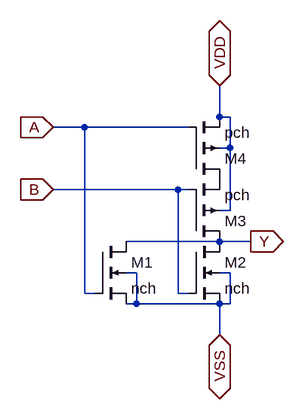
[diagram p0: schematic nor2.asc]
nor2.asc, the LTspice schematic file:
Version 4
SHEET 1 880 680
WIRE 272 0 272 -48
WIRE 288 0 272 0
WIRE 64 16 16 16
WIRE 224 16 64 16
WIRE 288 48 288 0
WIRE 288 48 272 48
WIRE 208 112 16 112
WIRE 224 112 208 112
WIRE 288 144 288 48
WIRE 288 144 272 144
WIRE 272 192 128 192
WIRE 320 192 272 192
WIRE 144 240 128 240
WIRE 288 240 272 240
WIRE 64 272 64 16
WIRE 80 272 64 272
WIRE 208 272 208 112
WIRE 224 272 208 272
WIRE 144 288 144 240
WIRE 144 288 128 288
WIRE 272 288 144 288
WIRE 288 288 288 240
WIRE 288 288 272 288
WIRE 272 336 272 288
FLAG 16 16 A
IOPIN 16 16 In
FLAG 16 112 B
IOPIN 16 112 In
FLAG 320 192 Y
IOPIN 320 192 Out
FLAG 272 336 VSS
IOPIN 272 336 BiDir
FLAG 272 -48 VDD
IOPIN 272 -48 BiDir
SYMBOL nmos4 80 192 R0
SYMATTR InstName M1
SYMATTR Value nch
SYMATTR Value2 l=ln w=wn
SYMBOL nmos4 224 192 R0
SYMATTR InstName M2
SYMATTR Value nch
SYMATTR Value2 l=ln w=wn
SYMBOL pmos4 224 192 M180
SYMATTR InstName M3
SYMATTR Value pch
SYMATTR Value2 l=lp w=wp
SYMBOL pmos4 224 96 M180
SYMATTR InstName M4
SYMATTR Value pch
SYMATTR Value2 l=lp w=wp

The netlist it stands for:
* nor2.asc
M1 Y A VSS VSS nch l=ln w=wn
M2 Y B VSS VSS nch l=ln w=wn
M3 Y B P001 VDD pch l=lp w=wp
M4 P001 A VDD VDD pch l=lp w=wp
.model NMOS NMOS
.model PMOS PMOS
.lib standard.mos
.backanno
.end